# Altium schematic sheet STM32RF_BME280.SchDoc
size A4; SheetNumber: 5; SheetTotal: 5
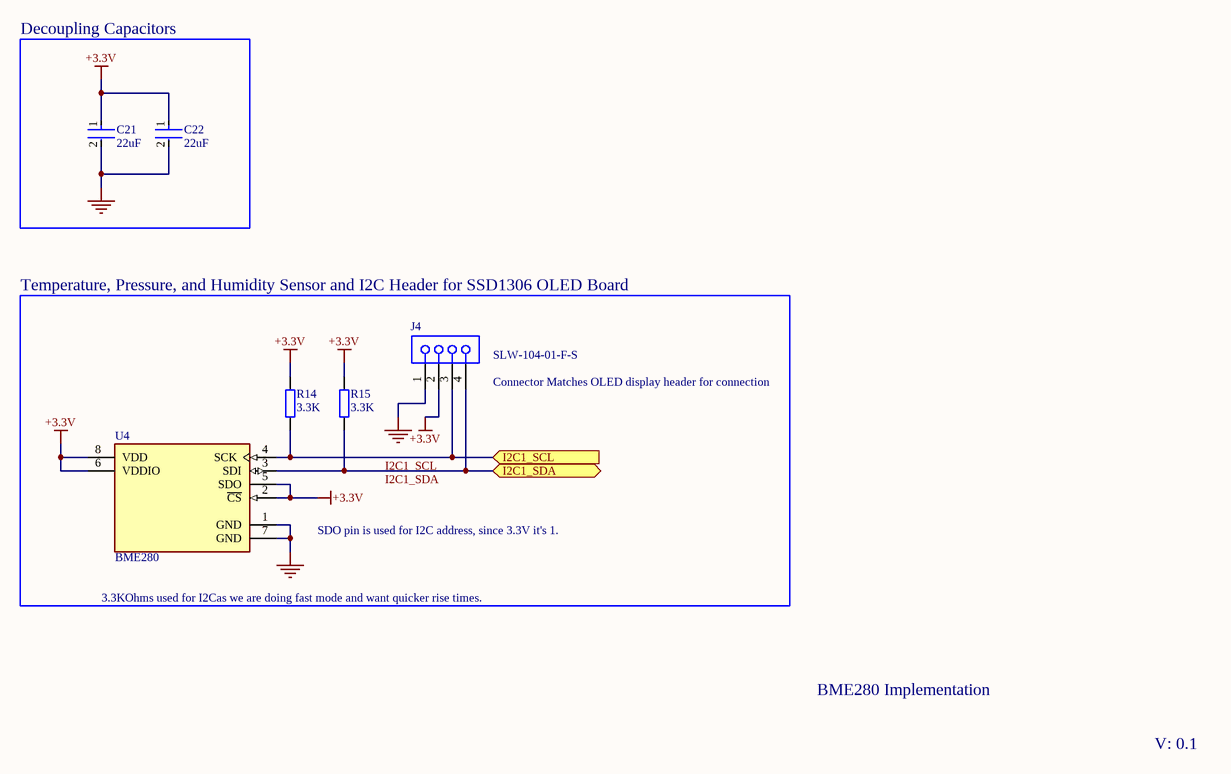
[diagram p0: STM32RF_BME280.SchDoc]

## Parts
C21  22uF  [FP-GRM158-0_2-MFG]
C22  22uF  [FP-GRM158-0_2-MFG]
J4  SLW-104-01-F-S  [SMTC-SLW-104-01-X-S]
R14  3.3K  [RES_0402]
R15  3.3K  [RES_0402]
U4  BME280  [FP-BME280-MFG]

## Blocks framed on the sheet
Decoupling Capacitors: C21 C22

## Ports
I2C1_SCL (in, see STM32RF_TopLevel[2C], STM32RF_MCU[1B]), I2C1_SDA (bidir, see STM32RF_TopLevel[2C], STM32RF_MCU[1B])

## Nets
+3.3V: C21.1 C22.1 J4.2 R14.2 R15.2 U4.2(~{CS}) U4.5(SDO) U4.6(VDDIO) U4.8(VDD)
GND: C21.2 C22.2 J4.1 U4.1(GND) U4.7(GND)
I2C1_SCL: J4.3 R14.1 U4.4(SCK) ; port I2C1_SCL
I2C1_SDA: J4.4 R15.1 U4.3(SDI) ; port I2C1_SDA

## Notes on the sheet
- Temperature, Pressure, and Humidity Sensor and I2C Header for SSD1306 OLED Board
- (near J4) Connector Matches OLED display header for connection
- SDO pin is used for I2C address, since 3.3V it's 1.
- 3.3KOhms used for I2Cas we are doing fast mode and want quicker rise times.
- BME280 Implementation
- V: 0.1

## Library data of the parts
C21 C22 = CMP-06035-020400-1: Chip Multilayer Ceramic Capacitors for General Purpose, 0402, 22uF, X5R, 15%, 20%, 10V
J4 = CMP-1023-00132-1: Low Profile Socket Strips, Through-hole, Vertical, -55 to 125 degC, 2.54 mm Pitch, 4-Pin, Female, RoHS; Manufacturer: Samtec; Pitch: 2.54 mm; PackageVersion: X, 9/1987; ComponentLink2Description: Datasheet; PackageDescription: Low Profile Socket Strip; ComponentLink1URL: http://www.samtec.com; Orientation: Vertical; ComponentLink3URL: http://www.samtec.com/documents/webfiles/cpdf/SLW-1XX-01-X-X-MKT.pdf; ComponentLink1Description: Manufacturer URL; ComponentLink2URL: http://www.samtec.com/documents/webfiles/pdf/SLW.PDF; PackageReference: SLW-104-01-X-S; Mounting Technology: Through-hole; PartNumber: SLW-104-01-F-S; Temperature Range: -55 to 125 degC; DatasheetVersion: F-214; ComponentLink3Description: Package Specification; RoHS: True
R14 R15 = RES_0402: Resistor SMD 0402; Manufacturer: *; Manufacturer Part Number: *; Distributor Link: *; LCSC: *
U4 = CMP-2000-05073-3: SENSOR PRESSURE HUMIDITY TEMP; Sensor Type: Temperature; Accuracy: 3%; Response Time: 1s; Output Type: SPI; Min Operating Temperature: -40°C; Max Operating Temperature: 85°C; Case/Package: LGA; Packaging: Cut Tape; Mount: Surface Mount; Lead Free: Lead Free; Number of Pins: 8